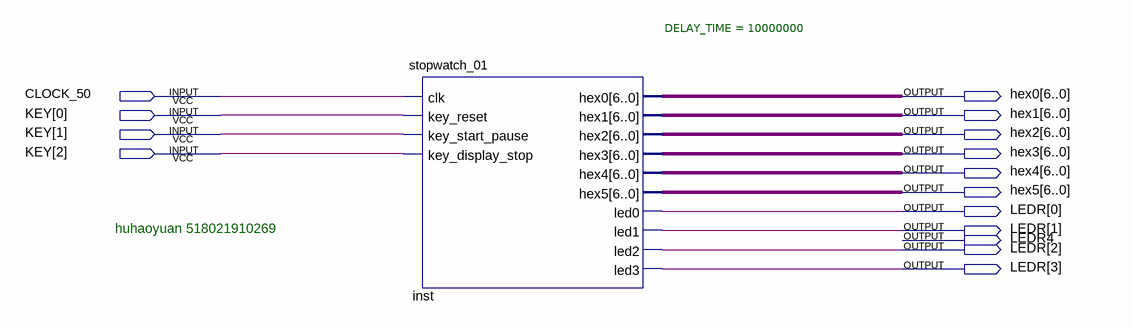
[diagram p0: schematic sheet]
// Quartus schematic Circut.bdf as structural Verilog: 1 symbols, 15 pins
module Circut (
  input  CLOCK_50,
  input  [2:0] KEY,
  output [6:0] hex0,
  output [6:0] hex1,
  output [6:0] hex2,
  output [6:0] hex3,
  output [6:0] hex4,
  output [6:0] hex5,
  output [3:0] LEDR,
  output LEDR4
);

  stopwatch_01 #(.DELAY_TIME(10000000)) inst (
    .clk(CLOCK_50), .key_reset(KEY[0]), .key_start_pause(KEY[1]), .key_display_stop(KEY[2]), .hex0(hex0),
    .hex1(hex1), .hex2(hex2), .hex3(hex3), .hex4(hex4), .hex5(hex5), .led0(LEDR[0]), .led1(LEDR[1]),
    .led2(LEDR[2]), .led3(LEDR[3]));

  // Notes on the sheet:
  //   huhaoyuan 518021910269
endmodule
